# EAGLE schematic Printrhub_Rev_0.1 (EAGLE 7.5.0)
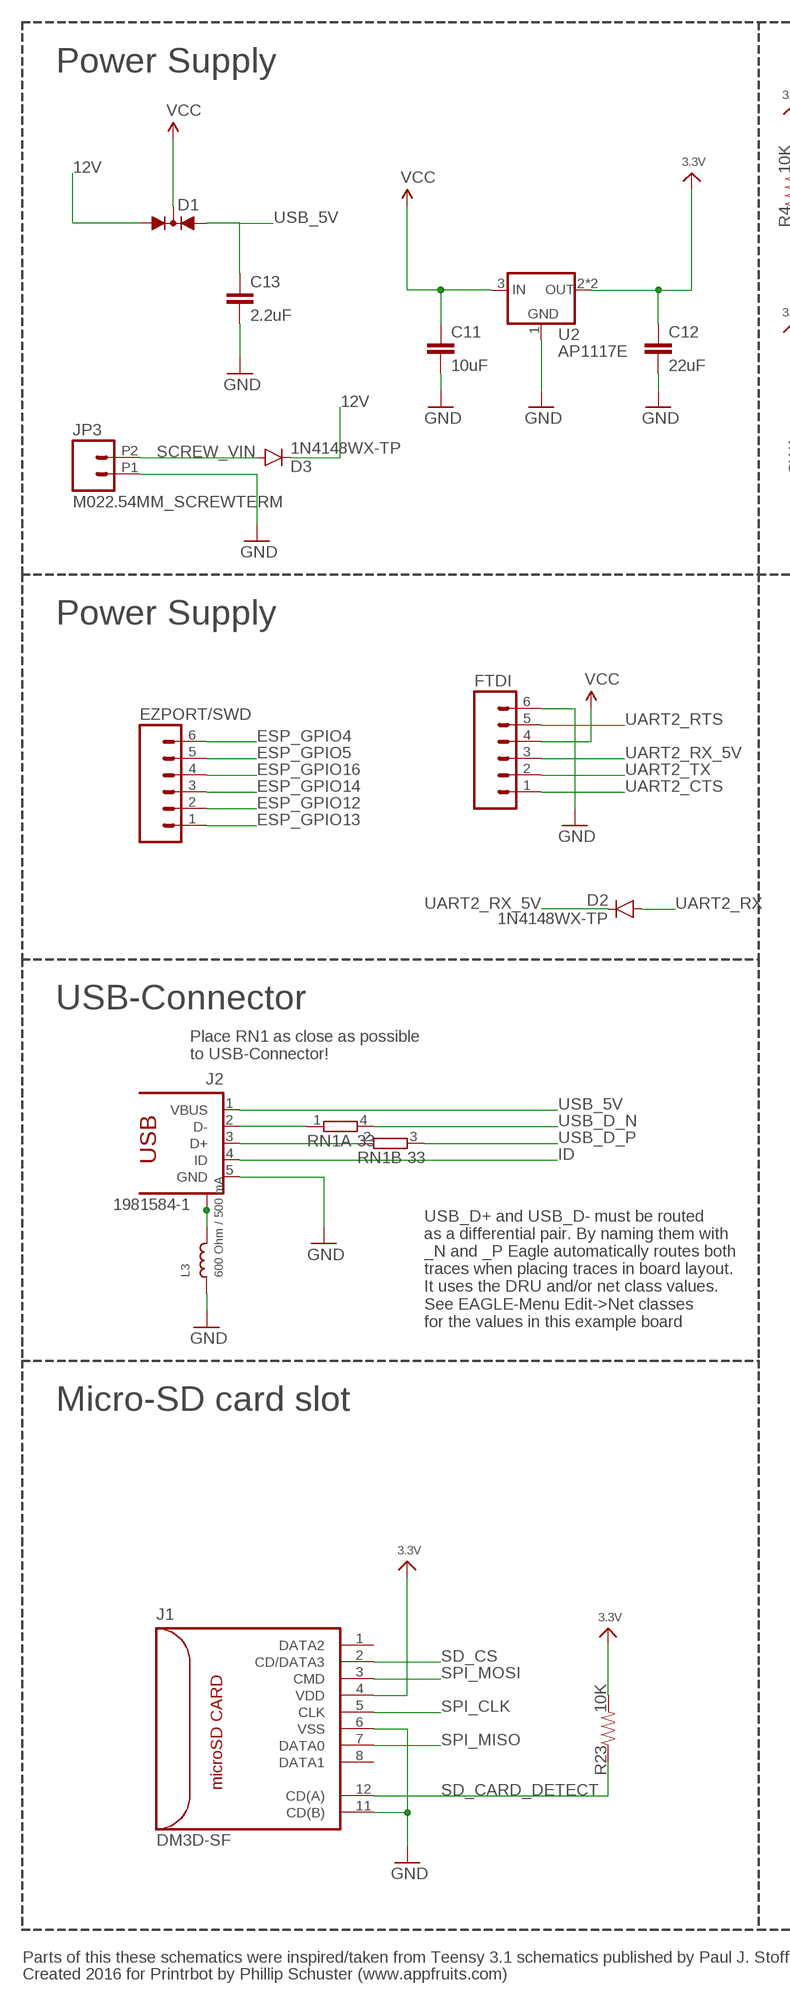
[diagram p0: schematic, sheet 1, part 1 of 2]
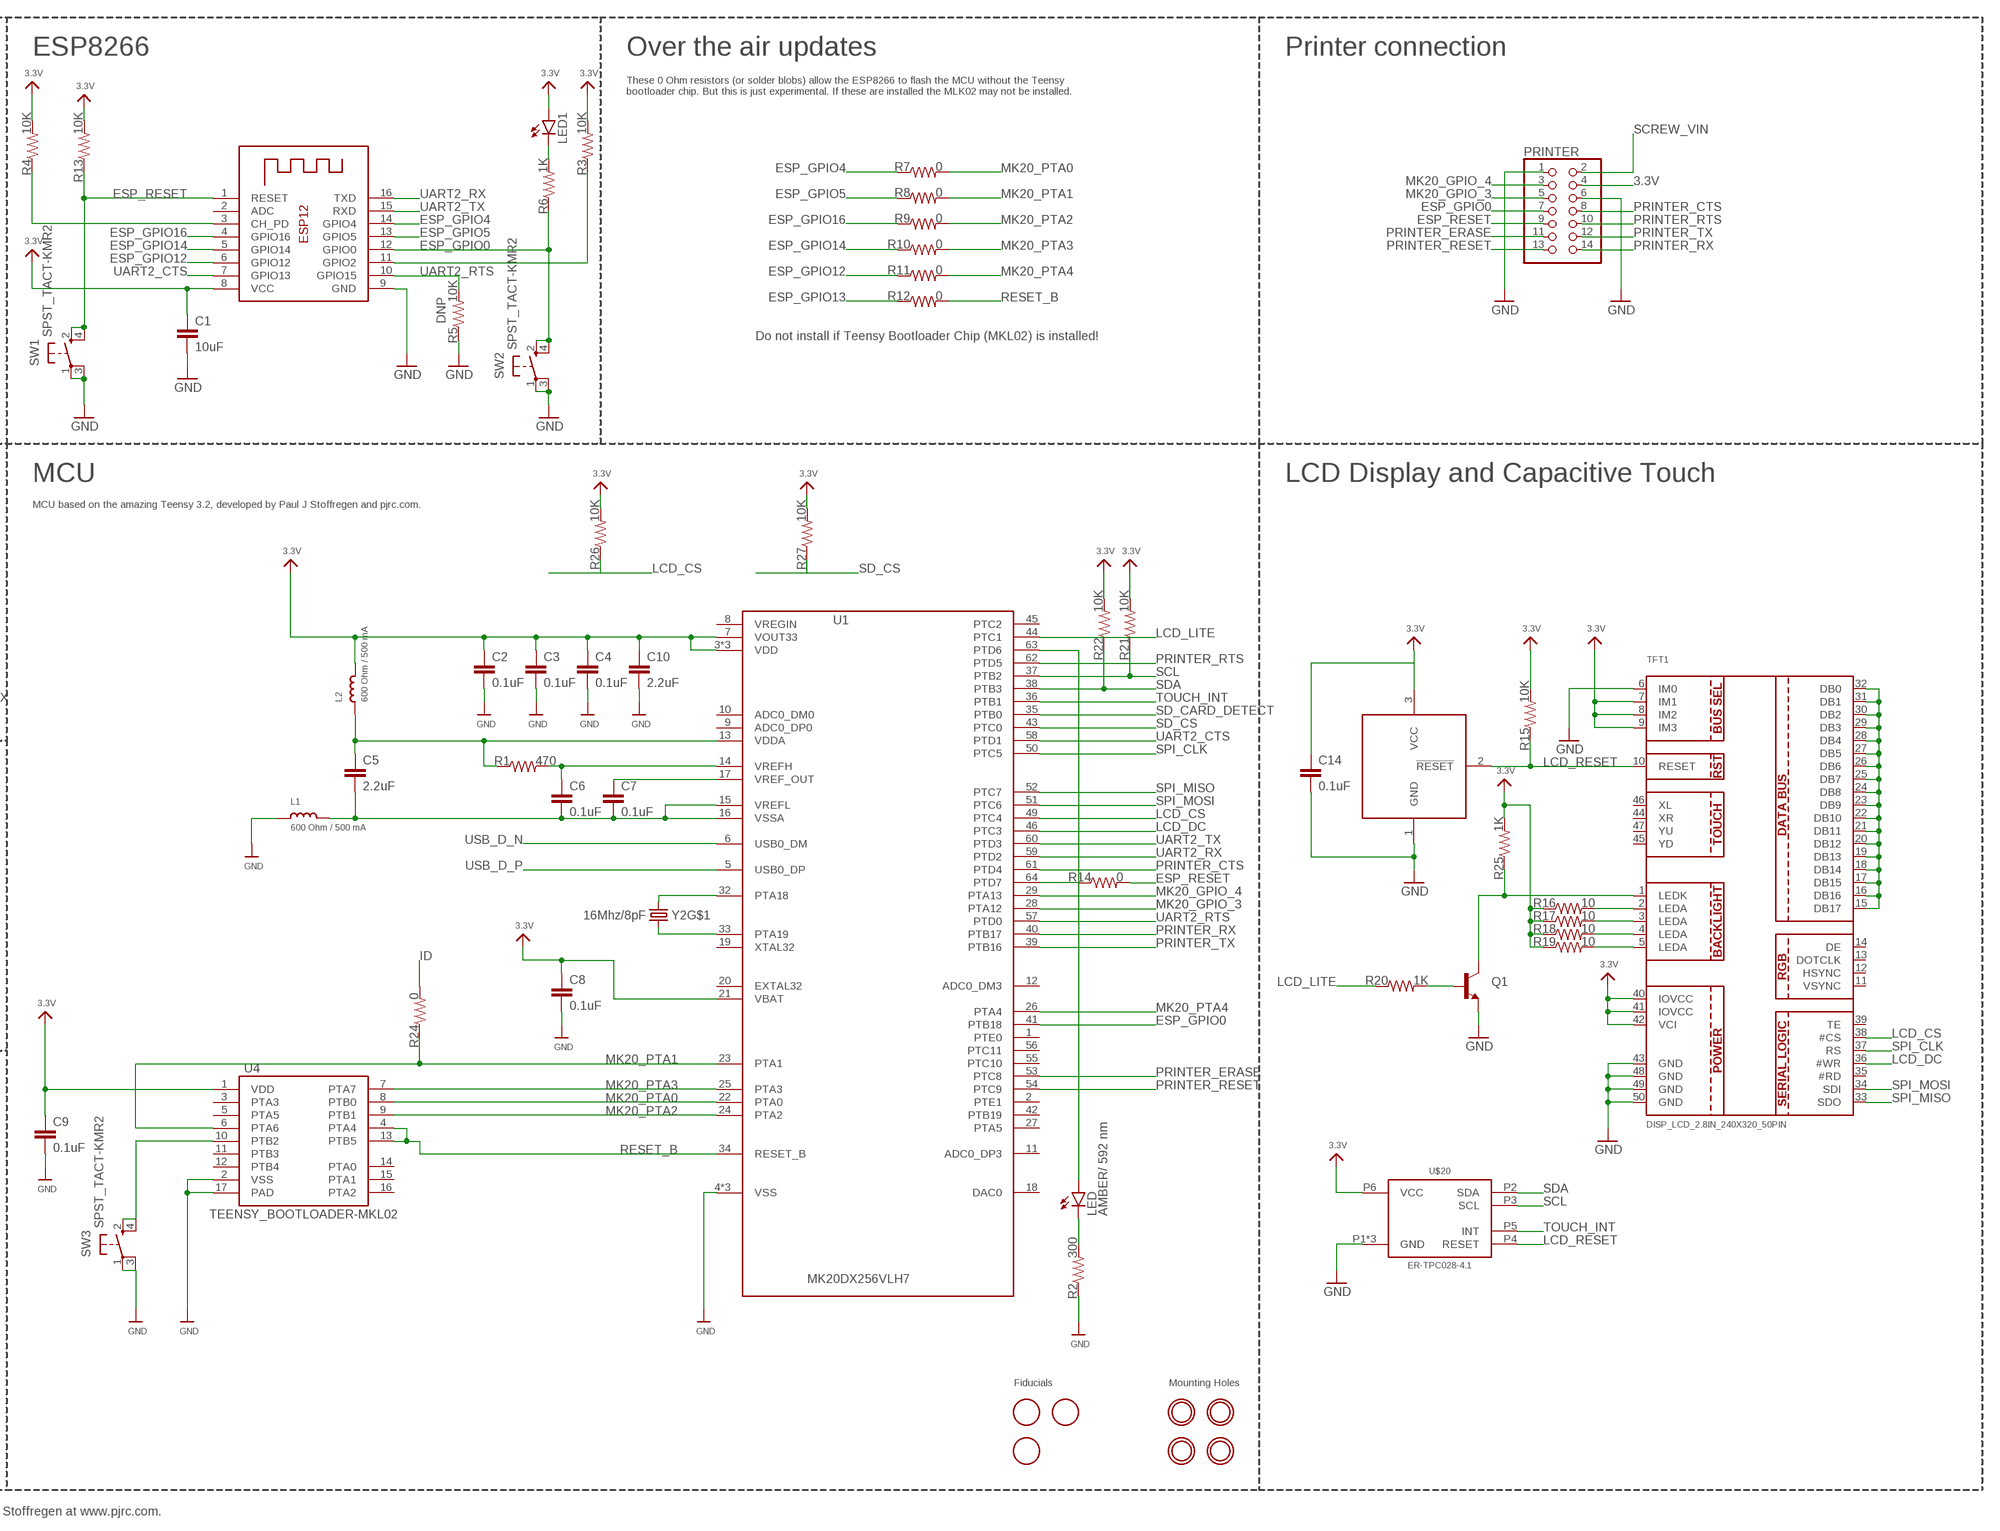
[diagram p1: schematic, sheet 1, part 2 of 2]

## Parts
C1  10uF  CAPACITOR-10UF  [0603-CAP]
C2  0.1uF  CAPACITOR-0.1UF  [0603-CAP]
C3  0.1uF  CAPACITOR-0.1UF  [0603-CAP]
C4  0.1uF  CAPACITOR-0.1UF  [0603-CAP]
C5  2.2uF  CAPACITOR-2.2UF  [0603-CAP]
C6  0.1uF  CAPACITOR-0.1UF  [0603-CAP]
C7  0.1uF  CAPACITOR-0.1UF  [0603-CAP]
C8  0.1uF  CAPACITOR-0.1UF  [0603-CAP]
C9  0.1uF  CAPACITOR-0.1UF  [0603-CAP]
C10  2.2uF  CAPACITOR-2.2UF  [0603-CAP]
C11  10uF  CAPACITOR-10UF  [0603-CAP]
C12  22uF  CAPACITOR-22UF  [0603-CAP]
C13  2.2uF  CAPACITOR-2.2UF  [0603-CAP]
C14  0.1uF  CAPACITOR-0.1UF  [0603-CAP]
D1  DIODE-2AC|CASOT23  [SOT23]
D2  1N4148WX-TP  DIODESOD  [SOD-323]
D3  1N4148WX-TP  DIODESOD  [SOD-323]
EZPORT/SWD  M06SMD-STRAIGHT  [1X06_SMD_STRAIGHT]
FTDI  M06SMD-STRAIGHT  [1X06_SMD_STRAIGHT]
J1  DM3D-SF  [DM3D-SF]
J2  1981584-1  [1981584-1]
JP3  M022.54MM_SCREWTERM  [1X02_2.54_SCREWTERM]
L1  600 Ohm / 500 mA  INDUCTOR-0603_600OHM/500MA  [0603]
L2  600 Ohm / 500 mA  INDUCTOR-0603_600OHM/500MA  [0603]
L3  600 Ohm / 500 mA  INDUCTOR-0603_600OHM/500MA  [0603]
LED  AMBER/ 592 nm  LED-AMBER  [LED-0603]
LED1  LED-GREEN  [LED-0603]
PRINTER  PINHD-2X7SMT  [2X07_SMT]
Q1  TRANSISTOR_NPNSOT23-3  [SOT23-3]
R1  470  RESISTOR-470  [0603-RES]
R2  300  RESISTOR0603  [0603-RES]
R3  10K  RESISTOR-10K  [0603-RES]
R4  10K  RESISTOR-10K  [0603-RES]
R5  10K  RESISTOR-10K  [0603-RES]
R6  1K  RESISTOR-1K  [0603-RES]
R7  0  RESISTOR-0  [0603-RES]
R8  0  RESISTOR-0  [0603-RES]
R9  0  RESISTOR-0  [0603-RES]
R10  0  RESISTOR-0  [0603-RES]
R11  0  RESISTOR-0  [0603-RES]
R12  0  RESISTOR-0  [0603-RES]
R13  10K  RESISTOR-10K  [0603-RES]
R14  0  RESISTOR-0  [0603-RES]
R15  10K  RESISTOR-10K  [0603-RES]
R16  10  RESISTOR-10  [0603-RES]
R17  10  RESISTOR-10  [0603-RES]
R18  10  RESISTOR-10  [0603-RES]
R19  10  RESISTOR-10  [0603-RES]
R20  1K  RESISTOR-1K  [0603-RES]
R21  10K  RESISTOR-10K  [0603-RES]
R22  10K  RESISTOR-10K  [0603-RES]
R23  10K  RESISTOR-10K  [0603-RES]
R24  0  RESISTOR-0  [0603-RES]
R25  1K  RESISTOR-1K  [0603-RES]
R26  10K  RESISTOR-10K  [0603-RES]
R27  10K  RESISTOR-10K  [0603-RES]
RN1  33  2R-NEXB34V  [EXB34V]
SW1  SPST_TACT-KMR2  [KMR2]
SW2  SPST_TACT-KMR2  [KMR2]
SW3  SPST_TACT-KMR2  [KMR2]
TFT1  DISP_LCD_2.8IN_240X320_50PIN  [TFT_2.83IN_240X320_50PIN]
U1  MK20DX256VLH7  [MK20DX256VLH7]
U2  AP1117E  [SOT223]
U3  MAX308-SOT23  [SOT23]
U4  TEENSY_BOOTLOADER-MKL02  [QFN50P300X300X100-17N]
U$15  MOUNTINGHOLE2.0  [MOUNTINGHOLE_2.0_PLATED]
U$16  MOUNTINGHOLE2.0  [MOUNTINGHOLE_2.0_PLATED]
U$17  MOUNTINGHOLE2.0  [MOUNTINGHOLE_2.0_PLATED]
U$18  MOUNTINGHOLE2.0  [MOUNTINGHOLE_2.0_PLATED]
U$20  ER-TPC028-4.1  [ER-CON06HB-1]
U$38  FIDUCIAL  [FIDUCIAL_1MM]
U$39  FIDUCIAL  [FIDUCIAL_1MM]
U$40  FIDUCIAL  [FIDUCIAL_1MM]
X1  ESP-12  [ESP-12]
Y2  16Mhz/8pF  CRYSTAL/SMD-5X3-GND16MHZ/8PF  [CRYSTAL-SMD-5X3]

## Nets
3.3V: C1.1 C2.1 C3.1 C4.1 C8.1 C9.1 C10.1 C12.1 C14.1 J1.4(VDD) L2.2 LED1.A PRINTER.4 R3.2 R4.2 R13.2 R15.2 R16.1 R17.1 R18.1 R19.1 R21.2 R22.2 R23.2 R25.2 R26.2 R27.2 TFT1.7(IM1) TFT1.8(IM2) TFT1.9(IM3) TFT1.40(IOVCC) TFT1.41(IOVCC) TFT1.42(VCI) U1.3(VDD) U1.7(VOUT33) U1.21(VBAT) U1.30(VDD) U1.48(VDD) U2.2(OUT) U2.4(OUT) U3.3(VCC) U4.1(VDD) U$20.P6(VCC) X1.8(VCC)
12V: D1.1(A1) D3.C
ESP_GPIO0: PRINTER.7 R6.1 SW2.2(S) SW2.4(S1) U1.41(PTB18) X1.12(GPIO0)
ESP_GPIO4: EZPORT/SWD.6 R7.1 X1.14(GPIO4)
ESP_GPIO5: EZPORT/SWD.5 R8.1 X1.13(GPIO5)
ESP_GPIO12: EZPORT/SWD.2 R11.1 X1.6(GPIO12)
ESP_GPIO13: EZPORT/SWD.1 R12.1
ESP_GPIO14: EZPORT/SWD.3 R10.1 X1.5(GPIO14)
ESP_GPIO16: EZPORT/SWD.4 R9.1 X1.4(GPIO16)
ESP_RESET: PRINTER.9 R13.1 R14.2 SW1.2(S) SW1.4(S1) X1.1(RESET)
GND [Top GND Pour]: C1.2 C2.2 C3.2 C4.2 C8.2 C9.2 C10.2 C11.2 C12.2 C13.2 C14.2 FTDI.6 J1.6(VSS) J1.11(CD(B)) J2.5(GND) JP3.P1 L1.1 L3.1 PRINTER.1 PRINTER.6 Q1.2(E) R2.1 R5.1 SW1.1(P) SW1.3(P1) SW2.1(P) SW2.3(P1) SW3.1(P) SW3.3(P1) TFT1.6(IM0) TFT1.43(GND) TFT1.48(GND) TFT1.49(GND) TFT1.50(GND) U1.4(VSS) U1.31(VSS) U1.47(VSS) U2.1(GND) U3.1(GND) U4.2(VSS) U4.17(PAD) U$20.P1(GND) U$20.PAD@0(GND) U$20.PAD@1(GND) X1.9(GND)
ID: J2.4(ID) R24.2
LCD_CS: R26.1 TFT1.38(#CS) U1.49(PTC4)
LCD_DC: TFT1.36(#WR) U1.46(PTC3)
LCD_LITE: R20.1 U1.44(PTC1)
LCD_RESET: R15.1 TFT1.10(RESET) U3.2(!RESET) U$20.P4(RESET)
MK20_GPIO_3: PRINTER.5 U1.28(PTA12)
MK20_GPIO_4: PRINTER.3 U1.29(PTA13)
MK20_PTA0: R7.2 U1.22(PTA0) U4.8(PTB0)
MK20_PTA1: R8.2 R24.1 U1.23(PTA1) U4.6(PTA6)
MK20_PTA2: R9.2 U1.24(PTA2) U4.9(PTB1)
MK20_PTA3: R10.2 U1.25(PTA3) U4.7(PTA7)
MK20_PTA4: R11.2 U1.26(PTA4)
N$1: R14.1 U1.64(PTD7)
N$4: R3.1 X1.11(GPIO2)
N$5: R4.1 X1.3(CH_PD)
N$7: LED1.C R6.2
N$10: Q1.3(C) R25.1 TFT1.1(LEDK)
N$11: R16.2 TFT1.2(LEDA)
N$12: LED.A U1.63(PTD6)
N$13: R17.2 TFT1.3(LEDA)
N$14: R18.2 TFT1.4(LEDA)
N$15: R19.2 TFT1.5(LEDA)
N$16: Q1.1(B) R20.2
N$17: TFT1.15(DB17) TFT1.16(DB16) TFT1.17(DB15) TFT1.18(DB14) TFT1.19(DB13) TFT1.20(DB12) TFT1.21(DB11) TFT1.22(DB10) TFT1.23(DB9) TFT1.24(DB8) TFT1.25(DB7) TFT1.26(DB6) TFT1.27(DB5) TFT1.28(DB4) TFT1.29(DB3) TFT1.30(DB2) TFT1.31(DB1) TFT1.32(DB0)
N$18: LED.C R2.2
N$27: U1.32(PTA18) Y2.3
N$28: U1.33(PTA19) Y2.1
PRINTER_CTS: PRINTER.8 U1.61(PTD4)
PRINTER_ERASE: PRINTER.11 U1.53(PTC8)
PRINTER_RESET: PRINTER.13 U1.54(PTC9)
PRINTER_RTS: PRINTER.10 U1.62(PTD5)
PRINTER_RX: PRINTER.14 U1.40(PTB17)
PRINTER_TX: PRINTER.12 U1.39(PTB16)
PROGRAM: SW3.2(S) SW3.4(S1) U4.10(PTB2)
RESET_B: R12.2 U1.34(RESET_B) U4.4(PTA4) U4.13(PTB5)
SCL: R21.1 U1.37(PTB2) U$20.P3(SCL)
SCREW_VIN: D3.A JP3.P2 PRINTER.2
SD_CARD_DETECT: J1.12(CD(A)) R23.1 U1.35(PTB0)
SD_CS: J1.2(CD/DATA3) R27.1 U1.43(PTC0)
SDA: R22.1 U1.38(PTB3) U$20.P2(SDA)
SPI_CLK: J1.5(CLK) TFT1.37(RS) U1.50(PTC5)
SPI_MISO: J1.7(DATA0) TFT1.33(SDO) U1.52(PTC7)
SPI_MOSI: J1.3(CMD) TFT1.34(SDI) U1.51(PTC6)
TOUCH_INT: U1.36(PTB1) U$20.P5(INT)
UART2_CTS: FTDI.1 U1.58(PTD1) X1.7(GPIO13)
UART2_RTS: FTDI.5 R5.2 U1.57(PTD0) X1.10(GPIO15)
UART2_RX: D2.A U1.59(PTD2) X1.16(TXD)
UART2_RX_5V: D2.C FTDI.3
UART2_TX: FTDI.2 U1.60(PTD3) X1.15(RXD)
USB_5V: C13.1 D1.2(A2) J2.1(VBUS)
USB_CON_N [USB]: J2.2(D-) RN1.1
USB_CON_P [USB]: J2.3(D+) RN1.2
USB_D_N [USB]: RN1.4 U1.6(USB0_DM)
USB_D_P [USB]: RN1.3 U1.5(USB0_DP)
USB_SHIELD: J2.S1 J2.S2 J2.S3 J2.S4 L3.2
VCC: C11.1 D1.3(C) FTDI.4 U2.3(IN)
VDDA: C5.1 L2.1 R1.1 U1.13(VDDA)
VREF_OUT: C7.1 U1.17(VREF_OUT)
VREFH: C6.1 R1.2 U1.14(VREFH)
VREFL: C5.2 C6.2 C7.2 L1.2 U1.15(VREFL) U1.16(VSSA)
Unconnected: J1.1(DATA2) J1.8(DATA1) J1.9(GND) J1.10(GND) J1.13(GND) J1.14(GND) TFT1.11(VSYNC) TFT1.12(HSYNC) TFT1.13(DOTCLK) TFT1.14(DE) TFT1.35(#RD) TFT1.39(TE) TFT1.44(XR) TFT1.45(YD) TFT1.46(XL) TFT1.47(YU) U1.1(PTE0) U1.2(PTE1) U1.8(VREGIN) U1.9(ADC0_DP0) U1.10(ADC0_DM0) U1.11(ADC0_DP3) U1.12(ADC0_DM3) U1.18(DAC0) U1.19(XTAL32) U1.20(EXTAL32) U1.27(PTA5) U1.42(PTB19) U1.45(PTC2) U1.55(PTC10) U1.56(PTC11) U4.3(PTA3) U4.5(PTA5) U4.11(PTB3) U4.12(PTB4) U4.14(PTA0) U4.15(PTA1) U4.16(PTA2) X1.2(ADC) Y2.2(GND:GND) Y2.4(GND:GND)

## Notes on the sheet
- Power Supply | ESP8266 | Over the air updates | Printer connection
- These 0 Ohm resistors (or solder blobs) allow the ESP8266 to flash the MCU without the Teensy
  bootloader chip. But this is just experimental. If these are installed the MLK02 may not be installed.
- DNP
- Do not install if Teensy Bootloader Chip (MKL02) is installed!
- Power Supply | MCU | LCD Display and Capacitive Touch
- MCU based on the amazing Teensy 3.2, developed by Paul J Stoffregen and pjrc.com.
- USB-Connector
- Place RN1 as close as possible
  to USB-Connector!
- USB_D+ and USB_D- must be routed
  as a differential pair. By naming them with
  _N and _P Eagle automatically routes both
  traces when placing traces in board layout.
  It uses the DRU and/or net class values. 
  See EAGLE-Menu Edit->Net classes 
  for the values in this example board
- Micro-SD card slot
- Fiducials | Mounting Holes
- Parts of this these schematics were inspired/taken from Teensy 3.1 schematics published by Paul J. Stoffregen at www.pjrc.com.
- Created 2016 for Printrbot by Phillip Schuster (www.appfruits.com)

## Library data of the parts
C1 C11 = appfruits:CAPACITOR; MF: Murata; MPN: GRM188R60J106ME47D
C2-C4 C6-C9 C14 = appfruits:CAPACITOR; MF: Kemet; MPN: C0603C104J3RACTU
C5 C10 C13 = appfruits:CAPACITOR; MF: Kemet; MPN: C0603C225K4PACTU
C12 = appfruits:CAPACITOR; MF: Murata; MPN: GRM188R60J226MEA0D
D1 = diode:DIODE-2AC|CA: Dual DIODE Anode-Cathode|Cathode-Anode
D2 D3 = SparkFun-DiscreteSemi:DIODE: Diode These are standard reverse protection diodes and small signal diodes. SMA package can handle up to about 1A. SOD-323 can handle about 200mA. What the SOD-323 package when ordering, there are some mfgs out there that are 5-pin packages.; MF: Micro Commercial Co; MPN: 1N4148WX-TP; PROD_ID: DIO-09646
EZPORT/SWD FTDI = SparkFun-Connectors:M06: Header 6 Standard 6-pin 0.1" header. Use with straight break away headers (SKU : PRT-00116), right angle break away headers (PRT-00553), swiss pins (PRT-00743), machine pins (PRT-00117), and female headers (PRT-00115). Molex polarized connector foot print use with SKU : PRT-08094 with associated crimp pins and housings. NOTES ON THE VARIANTS LOCK and LOCK_LONGPADS... This footprint was designed to help hold the alignment of a through-hole component (i.e. 6-pin header) while soldering it into place. You may notice that each hole has been shifted either up or down by 0.005 of an inch from it's more standard position (which is a perfectly straight line). This slight alteration caused the pins (the squares in the middle) to touch the edges of the holes. Because they are alternating, it causes a "brace" to hold the component in place. 0.005 has proven to be the perfect amount of "off-center" position when using our standard breakaway headers. Although looks a little odd when you look at the bare footprint, once you have a header in there, the alteration is very hard to notice. Also,if you push a header all the way into place, it is covered up entirely on the bottom side. This idea of altering the position of holes to aid alignment will be further integrated into the Sparkfun Library for other footprints. It can help hold any component with 3 or more connection pins.
J1 = con-sd-card:DM3D-SF: MICRO SD CONNECTOR
J2 = con-usb:1981584-1: Receptacle, micro-USB, type A/B Tyco Electronics
JP3 = SparkFun-Connectors:M02: Standard 2-pin 0.1" header. Use with - straight break away headers ( PRT-00116) - right angle break away headers (PRT-00553) - swiss pins (PRT-00743) - machine pins (PRT-00117) - female headers (PRT-00115) Molex polarized connector foot print use with: PRT-08233 with associated crimp pins and housings. 2.54_SCREWTERM for use with PRT-10571. 3.5mm Screw Terminal footprints for PRT-08084 5mm Screw Terminal footprints for use with PRT-08432
L1-L3 = appfruits:INDUCTOR: Inductors 0603: 10nH Ceramic Inductor - microwire antenna/RF (Digikey: 712-1434-2-ND) 0805: 560nH Ceramic Inductor - RF (Digikey: 553-1047-1-ND) 270nH Ceramic Inductor - Q = 40@250MHz, +-5%, 1 Ohm DC Resistance (Digikey: 535-10506-2-ND) 1007 (2518 Metric) SMT: 10µH 10% 250mOhm 820mA 1007 Inductor (Digikey: 587-2189-1-ND) 22µH 10% 500mOhm 580mA 1007 Inductor (Digikey: 587-2190-1-ND) 47µH 10% 950mOhm 420mA 1007 Inductor (Digikey: 587-2191-1-ND) 47µH 5% 100mOhm 1A 1008 Inductor (Digikey: 732-1816-1-ND) 5.0x5.0mm (Taiyo Yuden NR5040 Series) 6.8µH 20% 2.3A 64mOhm Inductor (Digikey: 587-2374-2-ND) 5.0x5.0mm (TDK VLC5045 Series) 4.7µH 20% 3.3A 34mOhm Inductor (Digikey: 445-6526-1-ND) 6.8µH 20% 2.7A 46mOhm Inductor (Digikey: 445-6527-1-ND) 6.0x6.0mm (TDK VLC6045 Series) 4.7µH 20% 3.8A 27mOhm Inductor (Digikey: 445-6538-2-ND) 6.8µH 20% 3A 41mOhm Inductor (Digikey: 445-6540-1-ND) 6.2µH 30% 2.2A 45mOhm Inductor (Digikey: SRR5028-6R2YCT-ND) - Not TDK VLC6045 but footprint should match 6.0x6.0mm (TDK SLF6045 Series) 6.8uH 30% 2A 33mOhm Inductor (Digikey: 445-4572-1-ND, Mouser: 810-SLF645T6R8N2R0PF) 6.0x6.0mm (Sumida CDRH5D28 Series) 6.2uH 30% 1.8A 45mOhm Inductor (Digikey: 308-1542-1-ND) Taiyo Yuden NR3015T2R2M - 2.2uH 20% 1.5A (Digikey: 587-1648-2-ND, Mouser: 963-NR3015T2R2M) - Used with TI TPS62172 CoilCraft RFID Transponder Coil - MA5532-AE (For use with AS3935 Lightning Sensor); MF: Murata; MPN: BLM18AG601SN1D
LED = appfruits:LED: LEDs Standard schematic elements and footprints for 5mm, 3mm, 1206, and 0603 sized LEDs. 5mm - Spark Fun Electronics SKU : COM-00529 (and others); MF: Avago Technologies; MPN: HSMA-C190
LED1 = appfruits:LED: LEDs Standard schematic elements and footprints for 5mm, 3mm, 1206, and 0603 sized LEDs. 5mm - Spark Fun Electronics SKU : COM-00529 (and others); MF: Avago; MPN: HSMG-C190
PRINTER = pinhead+:PINHD-2X7: PIN HEADER
Q1 = appfruits:TRANSISTOR_NPN: Generic NPN BJT MMBT2222A - TRANS-08049 (SOT-23, 1A 40V) MPSA42 - TRANS-09116 (SOT-23, 500mA 300V) MMBT5088LT1G - TRANS-11160 (SOT-23, 50 mA 30V) BC547 - COM-08928 <http://www.sparkfun.com/products/8928> (TO-92 45V 100mA) (1.Collector 2.Base 3.Emitter) 2N3904 - COM-00521 <http://www.sparkfun.com/products/521> (TO-92 40V 200mA) (1.Emitter 2.Base 3.Collector) P2N2222A - COM-12852 <http://www.sparkfun.com/products/12852> (TO-92 40V 600mA) (1.Collector 2.Base 3.Emitter); MF: ON Semiconductor; MPN: MMBT2222ALT1G
R1 = appfruits:RESISTOR: Resistor Basic schematic elements and footprints for 0603, 1206, and PTH resistors.; MF: Panasonic; MPN: ERJ-3GEYJ471V
R2 = appfruits:RESISTOR: Resistor Basic schematic elements and footprints for 0603, 1206, and PTH resistors.
R3-R5 R13 R15 R21-R23 R26 R27 = appfruits:RESISTOR: Resistor Basic schematic elements and footprints for 0603, 1206, and PTH resistors.; MF: Panasonic; MPN: ERJ-3GEYJ103V
R6 R20 R25 = appfruits:RESISTOR: Resistor Basic schematic elements and footprints for 0603, 1206, and PTH resistors.; MF: Panasonic; MPN: ERJ-3GEYJ102V
R7-R12 R14 R24 = appfruits:RESISTOR: Resistor Basic schematic elements and footprints for 0603, 1206, and PTH resistors.; MF: Panasonic; MPN: ERJ-3GEY0R00V
R16-R19 = appfruits:RESISTOR: Resistor Basic schematic elements and footprints for 0603, 1206, and PTH resistors.; MF: Panasonic; MPN: ERJ-3EKF10R0V
RN1 = resistor-dil:2R-N: Array Chip Resistor Source: Panasonic; MF: Panasonic; MPN: EXB-34V330JV; OC_FARNELL: unknown; OC_NEWARK: unknown
SW1-SW3 = adafruit:SPST_TACT: SMT 6mm switch, EVQQ2 series http://www.ladyada.net/library/eagle
TFT1 = appfruits:DISP_LCD_2.8IN_240X320_50PIN
U1 = appfruits:MK20DX256VLH7; MF: Freescale; MPN: MK20DX256VLH7
U2 = v-reg:AP1117: LDO Regulator
U3 = appfruits:MAX308: Reset Monitor for various drop voltages
U4 = appfruits:TEENSY_BOOTLOADER
U$15-U$18 = microbuilder:MOUNTINGHOLE: Mounting Hole For #2 screws (0.086"/2.18mm width, 0.094"/2.4mm hole) use 2.5mm
U$20 = appfruits:ER-TPC028-4.1: Connector for ER-TFT028-4 capacitive touch screen controller (buydisplay.com)
U$38-U$40 = adafruit:FIDUCIAL: For use by pick and place machines to calibrate the vision/machine, 1mm By microbuilder.eu
X1 = adafruit:ESP-12
Y2 = appfruits:CRYSTAL/SMD-5X3-GND; MF: ECS; MPN: ECS-160-8-30B-CKM

## Net classes
1 USB: width 0.267 mm, drill 0.33 mm, clearance 0.159 mm
2 Top GND Pour: clearance 0.762 mm to class 1